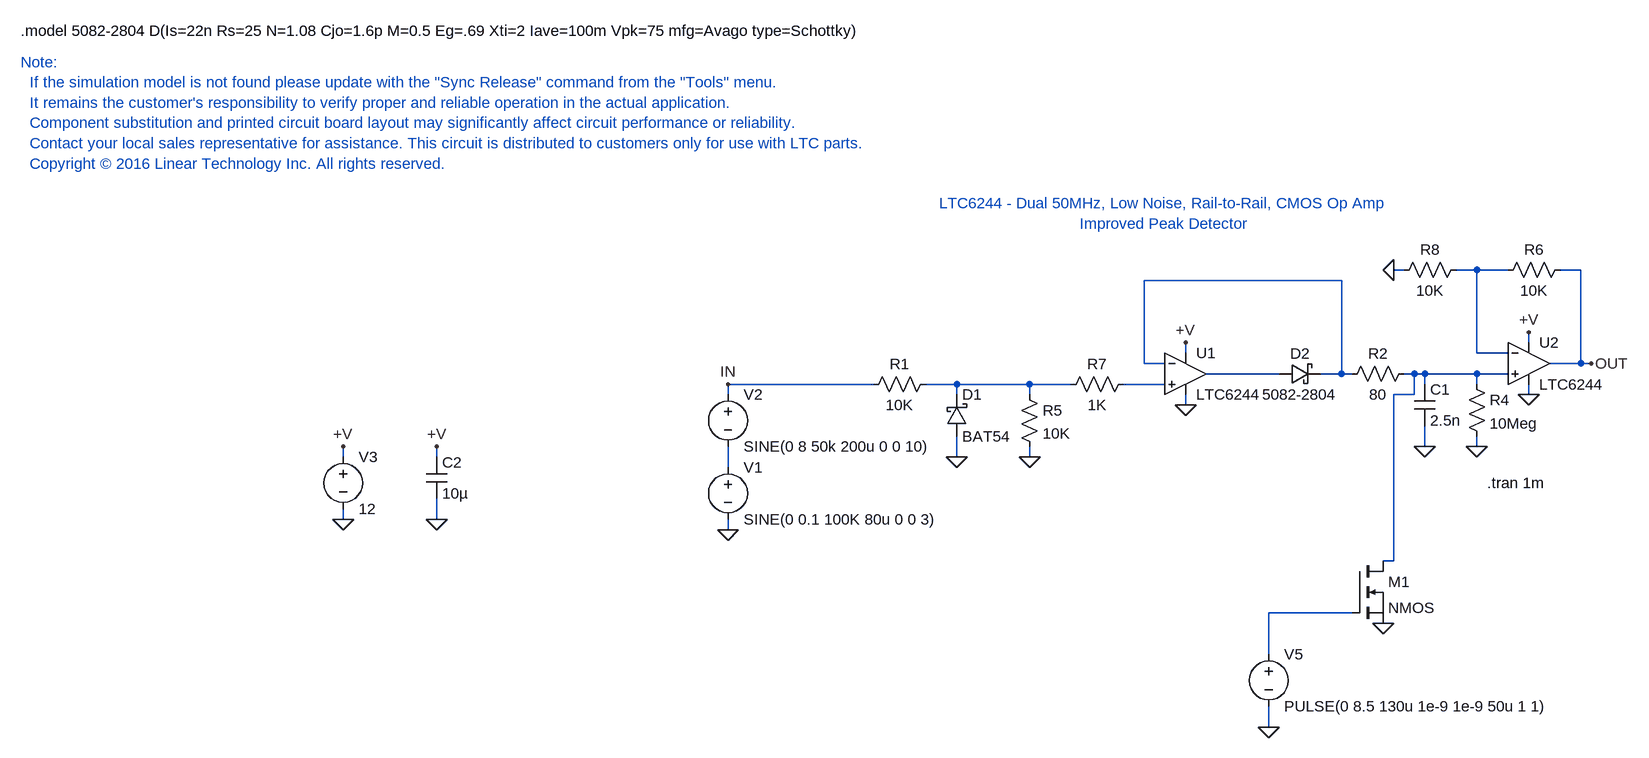
[diagram p0: schematic LTC6244_PeakDetector_Improved.asc]
LTC6244_PeakDetector_Improved.asc, the LTspice schematic file:
Version 4
SHEET 1 880 1712
WIRE -1040 0 -1056 0
WIRE -928 0 -960 0
WIRE -880 0 -928 0
WIRE -768 0 -800 0
WIRE -1136 16 -1440 16
WIRE -848 112 -848 96
WIRE -1376 128 -1376 112
WIRE -928 128 -928 0
WIRE -880 128 -928 128
WIRE -1440 144 -1440 16
WIRE -1408 144 -1440 144
WIRE -768 144 -768 0
WIRE -768 144 -816 144
WIRE -752 144 -768 144
WIRE -1232 160 -1344 160
WIRE -1136 160 -1136 16
WIRE -1136 160 -1168 160
WIRE -1120 160 -1136 160
WIRE -1024 160 -1040 160
WIRE -1008 160 -1024 160
WIRE -928 160 -1008 160
WIRE -880 160 -928 160
WIRE -1856 176 -2080 176
WIRE -1728 176 -1776 176
WIRE -1616 176 -1728 176
WIRE -1552 176 -1616 176
WIRE -1408 176 -1472 176
WIRE -1008 176 -1008 160
WIRE -928 176 -928 160
WIRE -2080 192 -2080 176
WIRE -1728 192 -1728 176
WIRE -1616 192 -1616 176
WIRE -1024 192 -1024 160
WIRE -1024 192 -1056 192
WIRE -848 192 -848 176
WIRE -1376 208 -1376 192
WIRE -1008 272 -1008 240
WIRE -928 272 -928 256
WIRE -2672 288 -2672 272
WIRE -2528 288 -2528 272
WIRE -1728 288 -1728 256
WIRE -1616 288 -1616 272
WIRE -2080 304 -2080 272
WIRE -2672 384 -2672 368
WIRE -2528 384 -2528 352
WIRE -2080 400 -2080 384
WIRE -1056 448 -1056 192
WIRE -1056 448 -1072 448
WIRE -1120 528 -1248 528
WIRE -1248 592 -1248 528
WIRE -1248 704 -1248 672
FLAG -2080 400 0
FLAG -2080 176 IN
FLAG -1376 208 0
FLAG -1376 112 +V
FLAG -1728 288 0
FLAG -1616 288 0
FLAG -1008 272 0
FLAG -928 272 0
FLAG -848 192 0
FLAG -752 144 OUT
FLAG -2672 384 0
FLAG -848 96 +V
FLAG -2528 272 +V
FLAG -1056 0 0
FLAG -1248 704 0
FLAG -1072 544 0
FLAG -2528 384 0
FLAG -2672 272 +V
SYMBOL voltage -2080 288 R0
WINDOW 123 0 0 Left 2
WINDOW 39 0 0 Left 2
SYMATTR InstName V1
SYMATTR Value SINE(0 0.1 100K 80u 0 0 3)
SYMBOL voltage -2080 176 R0
WINDOW 123 0 0 Left 2
WINDOW 39 0 0 Left 2
SYMATTR InstName V2
SYMATTR Value SINE(0 8 50k 200u 0 0 10)
SYMBOL res -1872 192 R270
WINDOW 0 32 56 VTop 2
WINDOW 3 0 56 VBottom 2
SYMATTR InstName R1
SYMATTR Value 10K
SYMBOL LTC6244 -1376 160 R0
SYMATTR InstName U1
SYMBOL cap -1024 176 R0
SYMATTR InstName C1
SYMATTR Value 2.5n
SYMBOL res -944 160 R0
SYMATTR InstName R4
SYMATTR Value 10Meg
SYMBOL schottky -1744 256 M180
WINDOW 0 24 64 Left 2
WINDOW 3 24 0 Left 2
SYMATTR InstName D1
SYMATTR Value BAT54
SYMATTR Description Diode
SYMATTR Type diode
SYMBOL schottky -1232 176 R270
WINDOW 0 32 32 VTop 2
WINDOW 3 0 32 VBottom 2
SYMATTR InstName D2
SYMATTR Value 5082-2804
SYMATTR Description Diode
SYMATTR Type diode
SYMBOL res -1632 176 R0
SYMATTR InstName R5
SYMATTR Value 10K
SYMBOL LTC6244 -848 144 R0
SYMATTR InstName U2
SYMBOL res -784 -16 R90
WINDOW 0 0 56 VBottom 2
WINDOW 3 32 56 VTop 2
SYMATTR InstName R6
SYMATTR Value 10K
SYMBOL res -1568 192 R270
WINDOW 0 32 56 VTop 2
WINDOW 3 0 56 VBottom 2
SYMATTR InstName R7
SYMATTR Value 1K
SYMBOL voltage -2672 272 R0
WINDOW 123 0 0 Left 2
WINDOW 39 0 0 Left 2
SYMATTR InstName V3
SYMATTR Value 12
SYMBOL res -944 -16 R90
WINDOW 0 0 56 VBottom 2
WINDOW 3 32 56 VTop 2
SYMATTR InstName R8
SYMATTR Value 10K
SYMBOL voltage -1248 576 R0
WINDOW 123 0 0 Left 2
WINDOW 39 0 0 Left 2
SYMATTR InstName V5
SYMATTR Value PULSE(0 8.5 130u 1e-9 1e-9 50u 1 1)
SYMBOL nmos -1120 448 R0
SYMATTR InstName M1
SYMBOL cap -2544 288 R0
SYMATTR InstName C2
SYMATTR Value 10µ
SYMBOL res -1024 144 R90
WINDOW 0 0 56 VBottom 2
WINDOW 3 32 56 VTop 2
SYMATTR InstName R2
SYMATTR Value 80
TEXT -3168 -368 Left 2 !.model 5082-2804 D(Is=22n Rs=25 N=1.08 Cjo=1.6p M=0.5 Eg=.69 Xti=2 Iave=100m Vpk=75 mfg=Avago type=Schottky)
TEXT -912 328 Left 2 !.tran 1m
TEXT -1408 -56 Bottom 2 ;LTC6244 - Dual 50MHz, Low Noise, Rail-to-Rail, CMOS Op Amp\nImproved Peak Detector
TEXT -3168 -320 Left 2 ;Note:\n  If the simulation model is not found please update with the "Sync Release" command from the "Tools" menu.\n  It remains the customer's responsibility to verify proper and reliable operation in the actual application.\n  Component substitution and printed circuit board layout may significantly affect circuit performance or reliability.\n  Contact your local sales representative for assistance. This circuit is distributed to customers only for use with LTC parts.\n  Copyright © 2016 Linear Technology Inc. All rights reserved.

The netlist it stands for:
* LTC6244_PeakDetector_Improved.asc
V1 N007 0 SINE(0 0.1 100K 80u 0 0 3)
V2 IN N007 SINE(0 8 50k 200u 0 0 10)
R1 IN N005 10K
XU1 N006 N002 +V 0 N003 LTC6244  ; pins In+ In- V+ V- OUT
C1 N004 0 2.5n
R4 N004 0 10Meg
D1 0 N005 BAT54
D2 N003 N002 5082-2804
R5 N005 0 10K
XU2 N004 N001 +V 0 OUT LTC6244  ; pins In+ In- V+ V- OUT
R6 OUT N001 10K
R7 N005 N006 1K
V3 +V 0 12
R8 N001 0 10K
V5 N008 0 PULSE(0 8.5 130u 1e-9 1e-9 50u 1 1)
M1 N004 N008 0 0 NMOS
C2 +V 0 10µ
R2 N004 N002 80
.model D D
.lib standard.dio
.model NMOS NMOS
.model PMOS PMOS
.lib standard.mos
.model 5082-2804 D(Is=22n Rs=25 N=1.08 Cjo=1.6p M=0.5 Eg=.69 Xti=2 Iave=100m Vpk=75 mfg=Avago type=Schottky)
.tran 1m
* LTC6244 - Dual 50MHz, Low Noise, Rail-to-Rail, CMOS Op Amp
* Improved Peak Detector
* Note:
*   If the simulation model is not found please update with the "Sync Release" command from the "Tools" menu.
*   It remains the customer's responsibility to verify proper and reliable operation in the actual application.
*   Component substitution and printed circuit board layout may significantly affect circuit performance or reliability.
*   Contact your local sales representative for assistance. This circuit is distributed to customers only for use with LTC parts.
*   Copyright © 2016 Linear Technology Inc. All rights reserved.
.backanno
.end